# EAGLE design MPR121_ATMega32u4 (EAGLE 6.4)
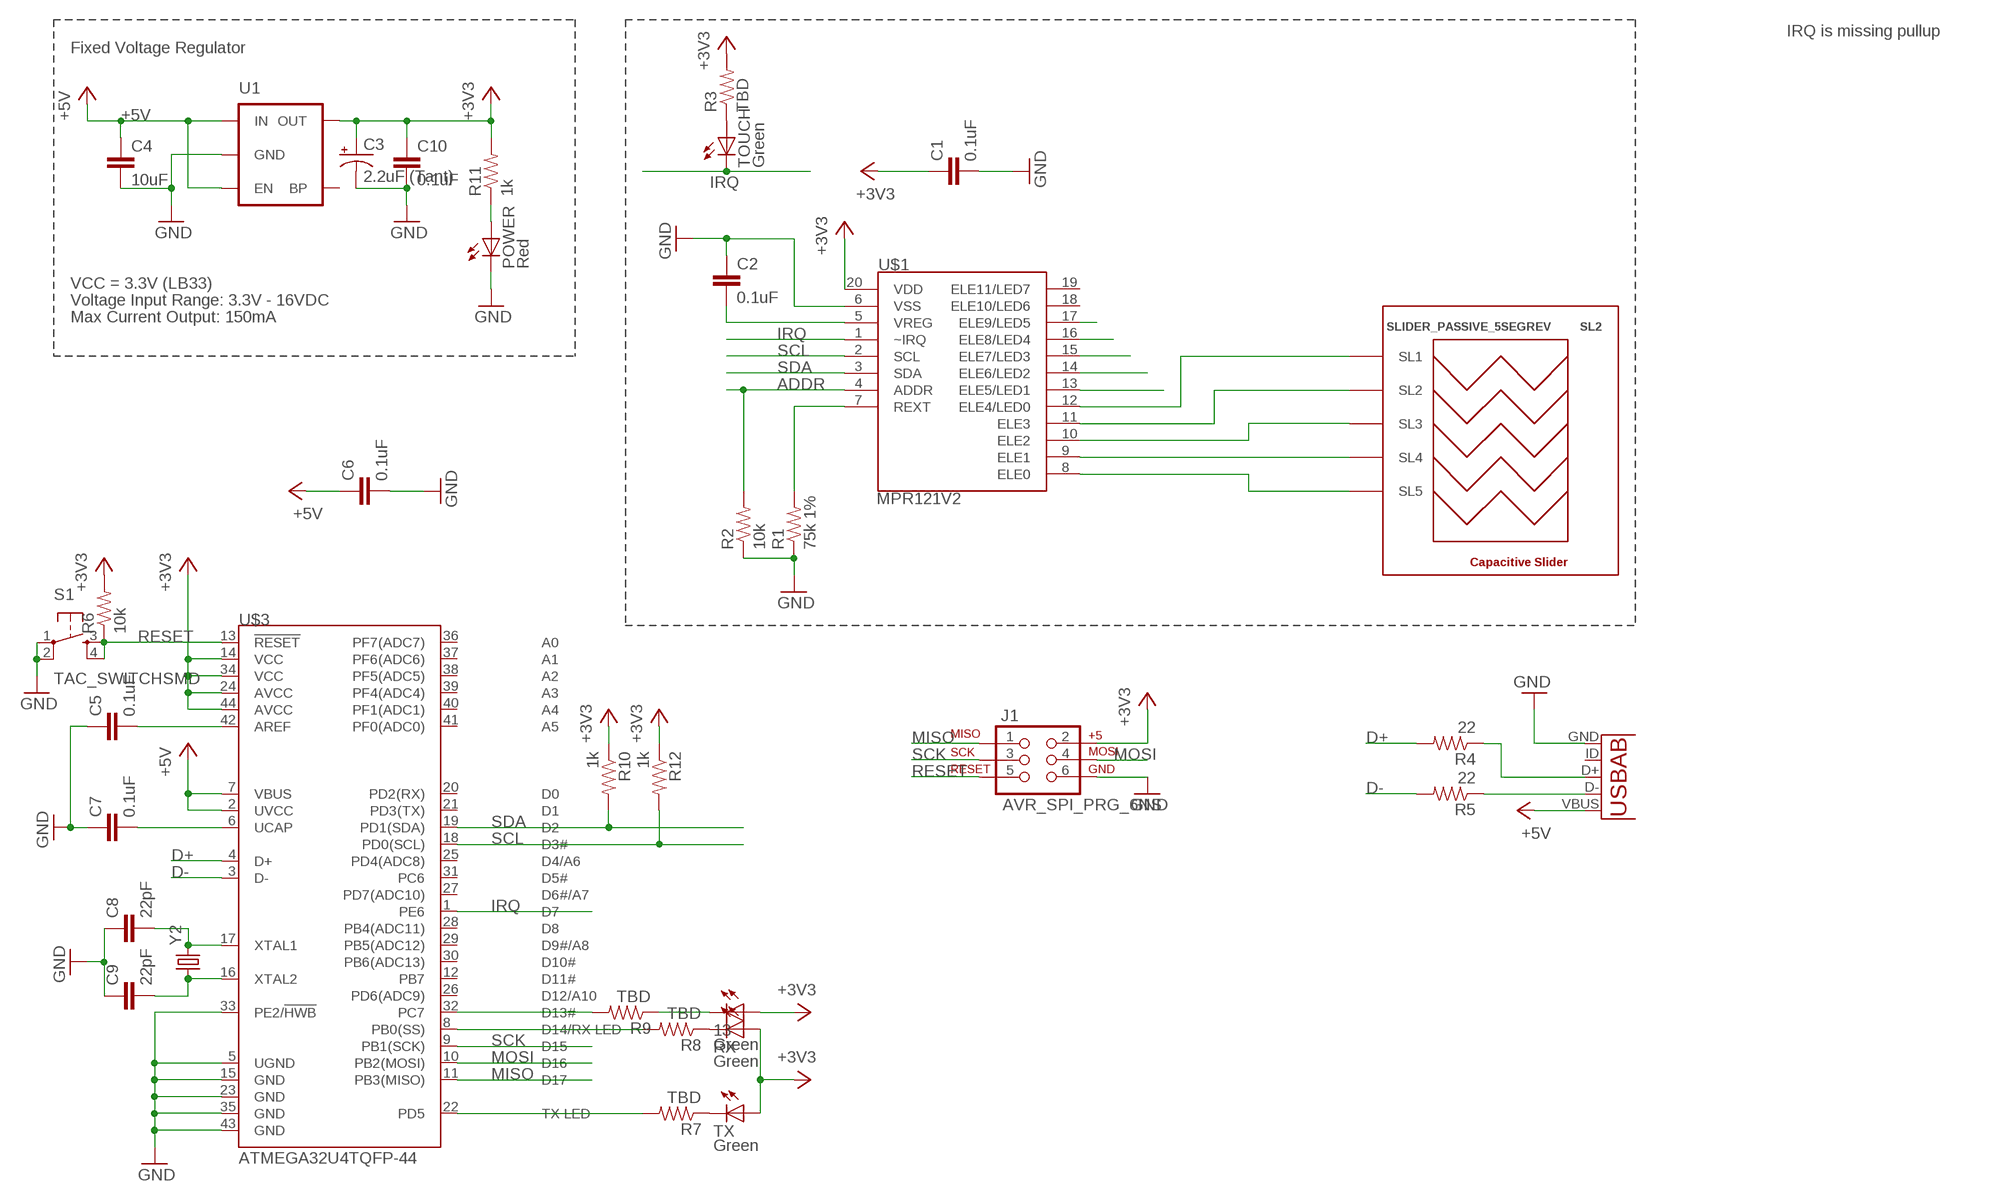
[diagram p0: schematic, sheet 1]

## Parts
13  Green  LED-RED1206  [LED-1206]
C1  0.1uF  CAP0805  [0805]
C2  0.1uF  CAP0805  [0805]
C3  2.2uF (Tant)  CAP_POL1206  [EIA3216]
C4  10uF  CAP1206  [1206]
C5  0.1uF  CAP0805  [0805]
C6  0.1uF  CAP0805  [0805]
C7  0.1uF  CAP0805  [0805]
C8  22pF  CAP0805  [0805]
C9  22pF  CAP0805  [0805]
C10  0.1uF  CAP0805  [0805]
J1  AVR_SPI_PRG_6NS  [2X3-NS]
POWER  Red  LED-RED1206  [LED-1206]
R1  75k 1%  RESISTOR0805-RES  [0805]
R2  10k  RESISTOR0805-RES  [0805]
R3  TBD  RESISTOR0805-RES  [0805]
R4  22  RESISTOR0805-RES  [0805]
R5  22  RESISTOR0805-RES  [0805]
R6  10k  RESISTOR0805-RES  [0805]
R7  TBD  RESISTOR0805-RES  [0805]
R8  TBD  RESISTOR0805-RES  [0805]
R9  TBD  RESISTOR0805-RES  [0805]
R10  1k  RESISTOR0805-RES  [0805]
R11  1k  RESISTOR0805-RES  [0805]
R12  1k  RESISTOR0805-RES  [0805]
RX  Green  LED-RED1206  [LED-1206]
S1  TAC_SWITCHSMD  [TACTILE-SWITCH-SMD]
SL2  SLIDER_PASSIVE_5SEGREV  [SLIDER_PASSIVE_5SEG_12MM_REV]
TOUCH  Green  LED-RED1206  [LED-1206]
TX  Green  LED-RED1206  [LED-1206]
U1  MIC52053.3V  [SOT23-5]
U2  USB-AB  [USB-AB-MICRO-SMD]
U$1  MPR121V2  [QFN-20-0.4MM-V2]
U$3  ATMEGA32U4TQFP-44  [TQFP44]
Y2  CRYSTAL5X3  [CRYSTAL-SMD-5X3]

## Nets
+3V3: 13.A C1.1 C3.A(+) C10.1 J1.2 R3.2 R6.2 R10.1 R11.2 R12.1 RX.A TX.A U1.5(OUT) U$1.20(VDD) U$3.14(VCC) U$3.24(AVCC) U$3.34(VCC) U$3.44(AVCC)
+5V: C4.1 C6.1 U1.1(IN) U1.3(EN) U2.VBUS U$3.2(UVCC) U$3.7(VBUS)
ADDR: R2.2 U$1.4(ADDR)
D+: R4.2 U$3.4(D+)
D-: R5.2 U$3.3(D-)
GND: C1.2 C2.1 C3.C(-) C4.2 C5.1 C6.2 C7.1 C8.1 C9.1 C10.2 J1.6 POWER.C R1.1 R2.1 S1.1 S1.2 U1.2(GND) U2.GND U$1.6(VSS) U$3.5(UGND) U$3.15(GND) U$3.23(GND) U$3.33(PE2/!HWB) U$3.35(GND) U$3.43(GND)
IRQ: TOUCH.C U$1.1(~IRQ) U$3.1(PE6)
MISO: J1.1 U$3.11(PB3(MISO))
MOSI: J1.4 U$3.10(PB2(MOSI))
N$1: C2.2 U$1.5(VREG)
N$2: R1.2 U$1.7(REXT)
N$3: SL2.SL5 U$1.8(ELE0)
N$4: SL2.SL4 U$1.9(ELE1)
N$5: SL2.SL3 U$1.10(ELE2)
N$6: SL2.SL2 U$1.11(ELE3)
N$7: SL2.SL1 U$1.12(ELE4/LED0)
N$8: U$1.13(ELE5/LED1)
N$9: U$1.14(ELE6/LED2)
N$10: U$1.15(ELE7/LED3)
N$11: U$1.16(ELE8/LED4)
N$12: U$1.17(ELE9/LED5)
N$13: R3.1 TOUCH.A
N$14: C7.2 U$3.6(UCAP)
N$15: C9.2 U$3.16(XTAL2) Y2.1
N$16: C8.2 U$3.17(XTAL1) Y2.3
N$17: R5.1 U2.D-
N$18: R4.1 U2.D+
N$19: R8.2 U$3.8(PB0(SS))
N$20: R7.2 U$3.22(PD5)
N$21: R8.1 RX.C
N$22: R7.1 TX.C
N$23: C5.2 U$3.42(AREF)
N$24: 13.C R9.1
N$25: R9.2 U$3.32(PC7)
N$38: POWER.A R11.1
RESET: J1.5 R6.1 S1.3 S1.4 U$3.13(!RESET)
SCK: J1.3 U$3.9(PB1(SCK))
SCL: R12.2 U$1.2(SCL) U$3.18(PD0(SCL))
SDA: R10.2 U$1.3(SDA) U$3.19(PD1(SDA))
Unconnected: U1.4(BP) U2.ID(USBID) U$1.18(ELE10/LED6) U$1.19(ELE11/LED7) U$3.12(PB7) U$3.20(PD2(RX)) U$3.21(PD3(TX)) U$3.25(PD4(ADC8)) U$3.26(PD6(ADC9)) U$3.27(PD7(ADC10)) U$3.28(PB4(ADC11)) U$3.29(PB5(ADC12)) U$3.30(PB6(ADC13)) U$3.31(PC6) U$3.36(PF7(ADC7)) U$3.37(PF6(ADC6)) U$3.38(PF5(ADC5)) U$3.39(PF4(ADC4)) U$3.40(PF1(ADC1)) U$3.41(PF0(ADC0))

## Notes on the sheet
- IRQ is missing pullup
- Fixed Voltage Regulator
- VCC = 3.3V (LB33)
- Voltage Input Range: 3.3V - 16VDC
- Max Current Output: 150mA

## Library data of the parts
13 POWER RX TOUCH TX = SparkFun-LED:LED-RED: Assorted Red LEDs LilyPad 1206- DIO-09912 1206- DIO-00809 0603- DIO-00819; PROD_ID: DIO-00809; VALUE: RED
C1 C2 C4-C10 = SparkFun-Capacitors:CAP: Capacitor Standard 0603 ceramic capacitor, and 0.1" leaded capacitor.
C3 = SparkFun-Capacitors:CAP_POL: Capacitor Polarized These are standard SMD and PTH capacitors. Normally 10uF, 47uF, and 100uF in electrolytic and tantalum varieties. Always verify the external diameter of the through hole cap, it varies with capacity, voltage, and manufacturer. The EIA devices should be standard.
J1 = SparkFun-Connectors:AVR_SPI_PRG_6: AVR ISP 6 Pin This is the reduced ISP connector for AVR programming. Common on Arduino. This footprint will take up less PCB space and can be used with a 10-pin to 6-pin adapter such as SKU: BOB-08508 **Special note about "TEST_POINT" package. The stop mask is on the top side, so if you want your programming test points to be on the bottom of your board, make sure to place this package on the bottom side of the board. This also ensure that the orientation to program from the bottom side will be correct.
R1-R3 R7-R10 R12 = SparkFun-Passives:RESISTOR: Resistor Basic schematic elements and footprints for 0603, 1206, and PTH resistors.
R4-R6 R11 = SparkFun-Resistors:RESISTOR: Resistor Basic schematic elements and footprints for 0603, 1206, and PTH resistors.
S1 = SparkFun-Electromechanical:TAC_SWITCH: Momentary Switch Button commonly used for reset or general input. Spark Fun Electronics SKU : COM-00097 SMT- SWCH-08247; PROD_ID: SWCH-08247
SL2 = PatternAgents-TouchWidgets:SLIDER_PASSIVE_5SEG: Slider, Passive Touch/Capacitive Sensing Type, Five (5) Segment Source : http://www.PatternAgents.com Github : https://github.com/PatternAgents License : http://creativecommons.org/licenses/by-sa/3.1/ (Creative Commons 3.1) THIS SOFTWARE IS PROVIDED BY THE CONTRIBUTORS "AS IS" AND WITHOUT ANY EXPRESS OR IMPLIED WARRANTIES, INCLUDING, BUT NOT LIMITED TO, THE IMPLIED WARRANTIES OF MERCHANTABILITY AND FITNESS FOR A PARTICULAR PURPOSE ARE DISCLAIMED. IN NO EVENT SHALL THE COPYRIGHT OWNER OR CONTRIBUTORS BE LIABLE FOR ANY DIRECT, INDIRECT, INCIDENTAL, SPECIAL, EXEMPLARY, OR CONSEQUENTIAL DAMAGES (INCLUDING, BUT NOT LIMITED TO, PROCUREMENT OF SUBSTITUTE GOODS OR SERVICES; LOSS OF USE, DATA, OR PROFITS; OR BUSINESS INTERRUPTION) HOWEVER CAUSED AND ON ANY THEORY OF LIABILITY, WHETHER IN CONTRACT, STRICT LIABILITY, OR TORT (INCLUDING NEGLIGENCE OR OTHERWISE) ARISING IN ANY WAY OUT OF THE USE OF THIS SOFTWARE, EVEN IF ADVISED OF THE POSSIBILITY OF SUCH DAMAGE.
U1 = SparkFun-PowerIC:MIC5205: MIC5205 150mA vreg 3.3V - VREG-00822 5V - VREG-00823; PROD_ID: VREG-00822
U2 = SparkFun-Connectors:USB-AB: This is a USB AB connector that is compatible with USB OTG. i.e. this connector can serve as a host or device
U$1 = SparkFun-Sensors:MPR121: MPR121 Capacitive Touch Sensor Controller. Variant "V2" was created using an image import of the bottom of the IC. It matches metal to metal.
U$3 = SparkFun-DigitalIC:ATMEGA32U4: Atmel 44-pin 8-bit Microcontroller with 32KBytes of ISP Flash and USB Controller
Y2 = SparkFun-FreqCtrl:CRYSTAL: Various standard crystals. Proven footprints. Spark Fun Electronics SKU : COM-00534

## Net classes
0 default: width 0.203 mm
1 vcc: width 0.254 mm

## Board
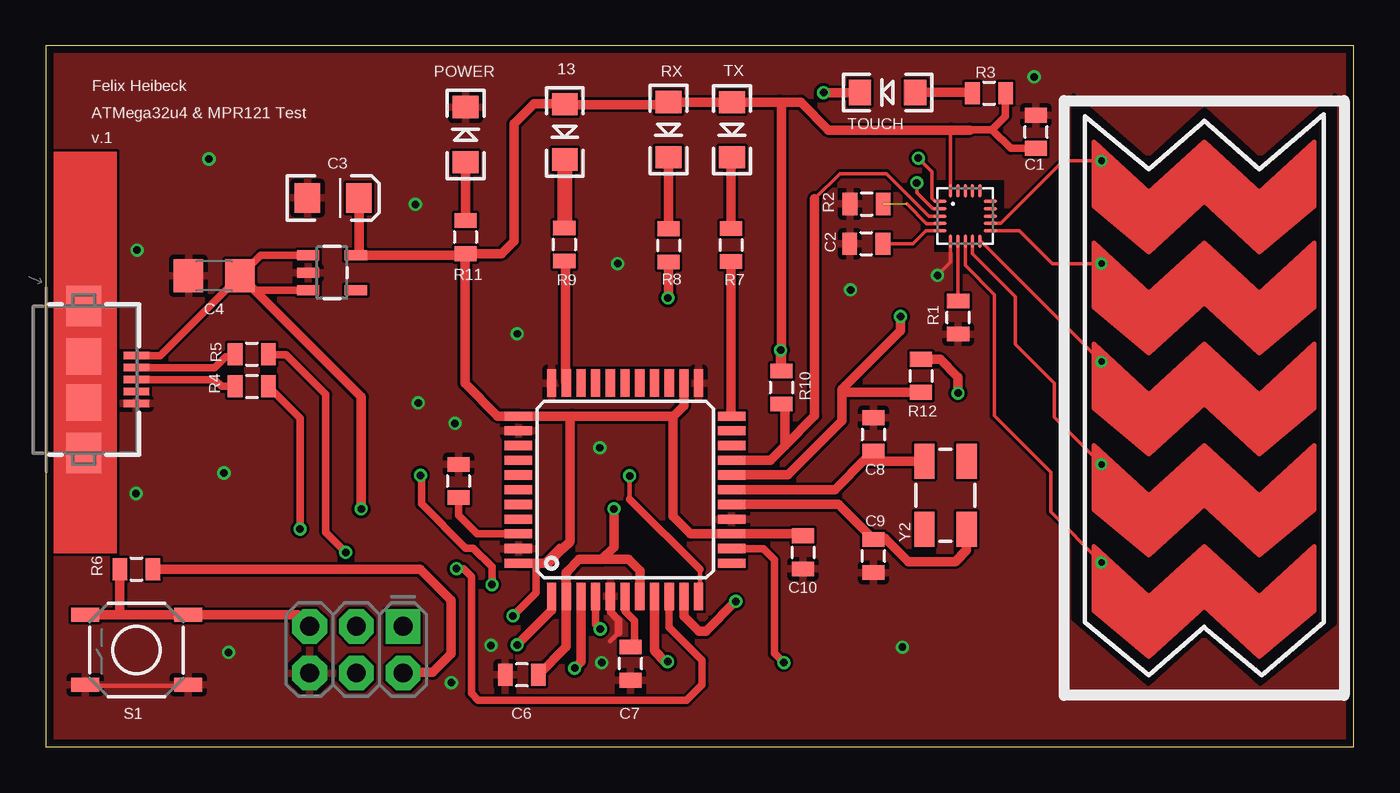
[diagram p1: board, top side]
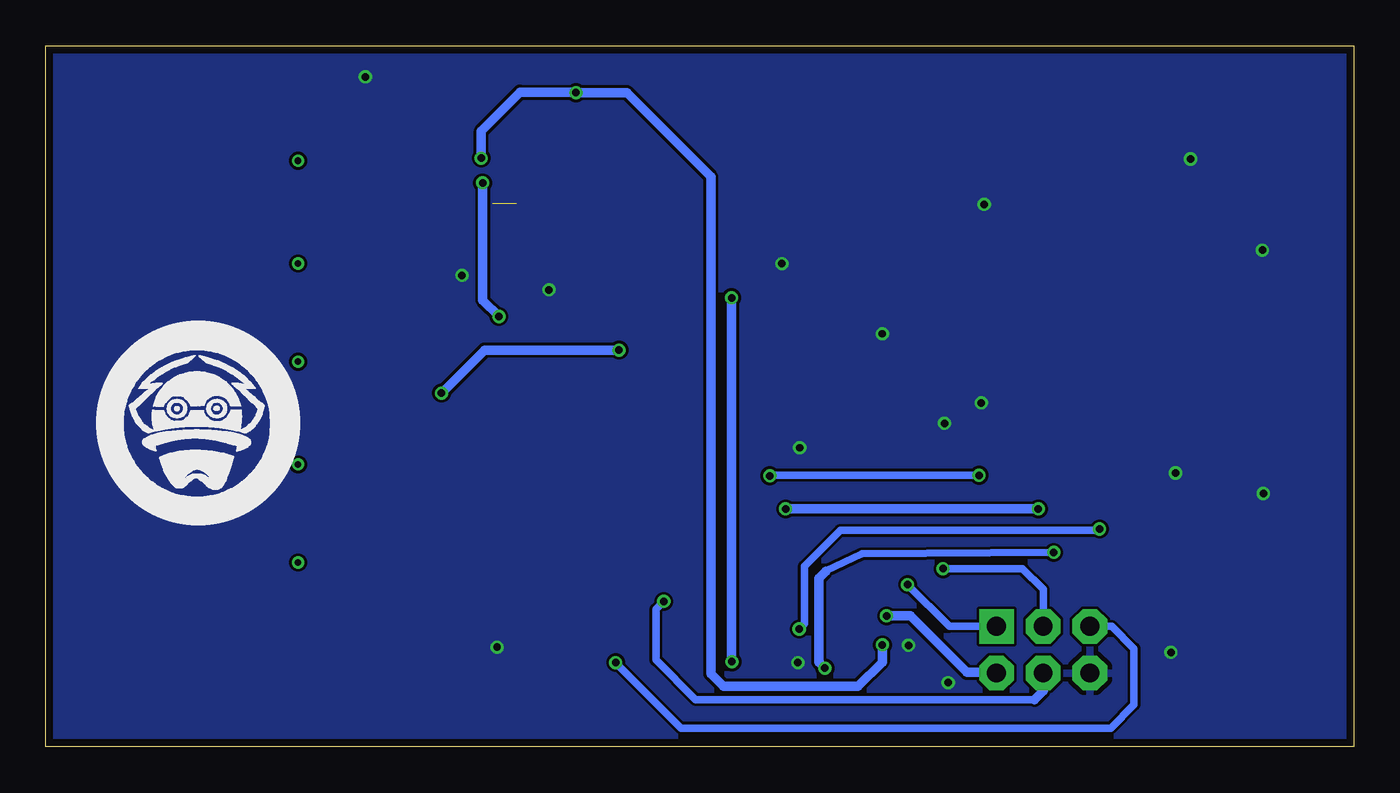
[diagram p2: board, bottom side, seen from below]

Size 71.12 x 38.1 mm. Coordinates in mm from the lower left corner, seen from the top.
Outline: 0,0 71.12,0 71.12,38.1 0,38.1 0,0
Copper layers (1*16): Top 0.035mm / dielectric 1.5mm / Bottom 0.035mm
Design rules "default *": minimum track width 10mil, minimum drill 24mil, track to track 6mil, track to pad 6mil, pad to pad 6mil, via to via 6mil, smd to smd 6mil, copper to edge 16mil, drill to drill 8mil, minimum pad ring 6mil, minimum via ring 6mil, stop-mask expansion 4mil, vias tented up to drill 0mil, thermal gap 10mil
tRestrict: area 48.3,26.9 to 52.1,30.8

### Footprints (pad centres in the part's own frame; a part is rotated, then mirrored left to right if it is on the bottom)
LED-1206 = smd 1.2 x 1.4: A -1.5,0; C 1.5,0
0805 = smd 0.8 x 1.2: 1 -0.9,0; 2 0.9,0
EIA3216 = smd 1.4 x 1.6: A 1.4,0; C -1.4,0
1206 = smd 1.6 x 1.8: 1 -1.4,0; 2 1.4,0
2X3-NS = drill 1.016 pad 1.88 square: 1 -2.54,-1.27 | drill 1.016 pad 1.88 octagon: 2 -2.54,1.27; 3 0,-1.27; 4 0,1.27; 5 2.54,-1.27; 6 2.54,1.27
TACTILE-SWITCH-SMD = smd 1.524 x 0.762: 1 -2.794,1.905; 2 2.794,1.905; 3 -2.794,-1.905; 4 2.794,-1.905
SLIDER_PASSIVE_5SEG_12MM_REV = drill 0.356: SL1 5.588,-13.208; SL2 5.588,-7.62; SL3 5.588,-2.286; SL4 5.588,3.302; SL5 5.588,8.636
SOT23-5 = smd 0.55 x 1.2: 1 -0.95,-1.3; 2 0,-1.3; 3 0.95,-1.3; 4 0.95,1.3; 5 -0.95,1.3
USB-AB-MICRO-SMD = smd 1.4 x 0.4: D+ 2.85,0; D- 2.85,0.65; GND 2.85,-1.3; ID 2.85,-0.65; VBUS 2.85,1.3 | smd 1.9 x 2: P$6 0,1.25; P$7 0,-1.25 | smd 1.9 x 2.2: P$8 0,4; P$9 0,-4
QFN-20-0.4MM-V2 = smd 0.75 x 0.195: 1 -1.367,0.8; 2 -1.367,0.4; 3 -1.367,0; 4 -1.367,-0.4; 5 -1.367,-0.8; 11 1.375,-0.8; 12 1.375,-0.4; 13 1.375,0; 14 1.375,0.4; 15 1.375,0.8 | smd 0.195 x 0.75: 6 -0.795,-1.372; 7 -0.395,-1.372; 8 0.005,-1.372; 9 0.405,-1.372; 10 0.805,-1.372; 16 0.81,1.372; 17 0.41,1.372; 18 0.01,1.372; 19 -0.39,1.372; 20 -0.79,1.372
TQFP44 = smd 1.5 x 0.5: 1 -5.8,4; 2 -5.8,3.2; 3 -5.8,2.4; 4 -5.8,1.6; 5 -5.8,0.8; 6 -5.8,0; 7 -5.8,-0.8; 8 -5.8,-1.6; 9 -5.8,-2.4; 10 -5.8,-3.2; 11 -5.8,-4; 23 5.8,-4; 24 5.8,-3.2; 25 5.8,-2.4; 26 5.8,-1.6; 27 5.8,-0.8; 28 5.8,0; 29 5.8,0.8; 30 5.8,1.6; 31 5.8,2.4; 32 5.8,3.2; 33 5.8,4 | smd 0.5 x 1.5: 12 -4,-5.8; 13 -3.2,-5.8; 14 -2.4,-5.8; 15 -1.6,-5.8; 16 -0.8,-5.8; 17 0,-5.8; 18 0.8,-5.8; 19 1.6,-5.8; 20 2.4,-5.8; 21 3.2,-5.8; 22 4,-5.8; 34 4,5.8; 35 3.2,5.8; 36 2.4,5.8; 37 1.6,5.8; 38 0.8,5.8; 39 0,5.8; 40 -0.8,5.8; 41 -1.6,5.8; 42 -2.4,5.8; 43 -3.2,5.8; 44 -4,5.8
CRYSTAL-SMD-5X3 = smd 1.9 x 1.1: 1 -1.85,-1.15; 2 1.85,-1.15; 3 1.85,1.15; 4 -1.85,1.15

### Placement (x,y rotation side)
13  28.22,33.43 270 top
C1  53.85,33.43 90 top
C2  44.62,27.35 0 top
C3  15.62,29.83 0 top
C4  9.16,25.6 180 top
C5  22.44,14.44 270 top
C6  25.88,3.91 180 top
C7  31.79,4.52 90 top
C8  45.01,16.98 270 top
C9  45.01,10.37 90 top
C10  41.18,10.57 270 top
J1  16.88,5.28 180 top
POWER  22.82,33.28 90 top
R1  49.61,23.33 90 top
R2  44.63,29.51 0 top
R3  51.3,35.54 0 top
R4  11.19,19.59 0 top
R5  11.2,21.34 0 top
R6  4.92,9.66 0 top
R7  37.27,27.28 270 top
R8  33.86,27.26 270 top
R9  28.19,27.3 270 top
R10  40.01,19.53 270 top
R11  22.82,27.71 270 top
R12  47.6,20.17 270 top
RX  33.86,33.55 270 top
S1  4.93,5.26 180 top
SL2  63,18.65 180 top
TOUCH  45.78,35.57 180 top
TX  37.32,33.55 270 top
U1  15.56,25.78 270 top
U2  2.07,19.96 0 top
U$1  49.99,28.85 0 top
U$3  31.5,13.98 90 top
Y2  48.92,13.68 90 top

### Tracks (layer width: path | path; a pad name or v marks a point on that pad's centre or on a via)
+3V3  (via drill 0.41)
  Top 0.203: U$1.20 49.2,33.51 49.23,33.53
  Top 0.254: 26.67,9.65 27.94,10.92 28.11,10.76
  Top 0.406: v25.4,7.11 26.67,8.38 26.67,9.65 | R3.2 52.2,34.29 51.46,33.55 | 51.46,33.55 50.27,33.55 50.24,33.53 | C1.1 52.48,32.53 51.46,33.55
  Top 0.508: C10.1 41.08,11.57 U$3.14 35.06,11.57 34.11,12.52 34.11,17.96 34.13,17.98 | 28.6,17.98 U$3.34 24.57,17.98 22.78,19.76 22.78,26.77 R11.2 | 28.6,17.98 34.13,17.98 | 34.13,17.98 34.7,18.54 U$3.24 | U$3.44 27.32,9.97 28.11,10.76 28.5,11.15 28.5,17.87 28.6,17.98 | 39.88,35.05 TX.A RX.A 33.7,34.89 28.25,34.89 13.A 28.2,34.95 26.54,34.95 25.45,33.86 25.45,27.48 24.77,26.81 R11.2 | 39.88,35.05 41.05,35.05 42.57,33.53 49.23,33.53 50.24,33.53 | R11.2 22.74,26.73 U1.5 17.02,26.89 C3.A | R6.2 20.34,9.66 22.05,7.95 22.05,5.05 21.03,4.04 19.45,4.04 J1.2 | v39.95,21.57 39.95,20.43 R10.1 40.01,34.92 39.88,35.05 | v49.61,19.23 49.61,20.09 48.64,21.06 47.61,21.06 R12.1
  Bottom 0.508: v25.4,7.11 24.11,7.11 21.03,4.04 19.45,4.04 J1.2 | v39.95,21.57 47.27,21.57 v49.61,19.23
+5V  (via drill 0.41)
  Top 0.406: U2.VBUS 6.22,21.26 C4.1 | U1.1 11.68,26.73 C4.1 | U1.3 11.33,24.83 10.93,25.23 C4.1
  Top 0.508: U$3.7 32.3,9.56 31.67,10.19 30.23,10.19 | U$3.2 28.3,9.45 28.37,9.53 28.37,9.55 29.01,10.19 30.23,10.19 | U$3.2 | U$3.2 28.3,5.42 C6.1 | 30.23,10.19 30.89,10.85 v30.89,12.93 | v17.14,12.93 17.14,19.02 10.93,25.23
  Bottom 0.508: v30.89,12.93 v17.14,12.93
ADDR  (1 unrouted)
  Top 0.203: 46.82,29.51 47.88,28.45 48.62,28.45 U$1.4
D+  (via drill 0.41)
  Top 0.406: U$3.4 29.9,6.65 v30.15,6.4 | v13.82,11.84 13.82,17.86 R4.2
  Bottom 0.406: v30.15,6.4 29.87,6.68 29.87,9.8 27.91,11.76 13.89,11.76 v13.82,11.84
D-  (via drill 0.41)
  Top 0.406: R5.2 12.13,21.31 13.06,21.31 15.21,19.15 15.21,11.66 v16.31,10.57
  Top 0.508: U$3.3 29.1,4.61 v28.75,4.27
  Bottom 0.406: 28.7,9.55 28.7,9.58 26.75,10.49 16.26,10.57 v16.31,10.57
  Bottom 0.508: v28.75,4.27 29.08,4.6 29.08,9.17 28.7,9.55
GND  (via drill 0.41)
  Top 0.203: U$1.6 49.2,26.34 v48.49,25.63
  Top 0.254: S1.2 2.54,3.3 7.62,3.3 S1.1 | 35.56,19.81 U$3.23 | 25.4,10.92 U$3.43 | 25.4,17.27 U$3.35 | 31.75,3.3 C7.1 | 13.97,29.97 C3.C | 22.86,35.05 POWER.C | 31.14,6.2 30.68,5.74
  Top 0.406: U$3.5 30.7,7.33 31.14,6.88 31.14,6.2
  other vias: 22.25,17.58 30.23,4.57 53.75,36.42 43.76,24.84 4.95,27 4.9,13.77 9.68,14.88 20.24,18.69 25.63,22.45 31.09,26.26 30.12,16.26 46.58,5.41 9.93,5.13 8.86,31.95 20.09,29.49 24.21,5.51 22.05,3.48
  pour Top (rank 2): -0.51,39.12 77.22,39.12 77.22,-1.27 -0.51,-1.27
  pour Bottom: -0.76,39.37 77.22,39.37 77.22,-1.27 -0.76,-1.27 -0.76,39.12
IRQ  (via drill 0.41)
  Top 0.203: U$1.1 48.35,29.65 48.18,29.82 48.18,31.27 v47.45,32
  Top 0.508: v42.29,35.56 44.27,35.56 TOUCH.C | U$3.1 27.5,7.41 v25.63,5.54
  Bottom 0.508: v47.45,32 47.45,33.48 45.34,35.59 42.32,35.59 v42.29,35.56 39.52,35.56 34.95,30.99 34.95,3.96 34.27,3.28 26.95,3.28 25.63,4.6 v25.63,5.54
MISO  (via drill 0.41)
  Top 0.254: 35.56,9.65 35.56,8.38 U$3.11 | v31.75,14.73 31.75,13.46
  Top 0.406: 31.75,13.46 35.56,9.65 | v24.26,8.81 24.26,9.78 23.24,10.79 22.84,10.79 20.42,13.21 20.42,14.71 v20.37,14.76
  Bottom 0.406: J1.1 21.99,6.55 v24.26,8.81 | v20.37,14.76 31.73,14.76 v31.75,14.73
MOSI  (via drill 0.41)
  Top 0.508: U$3.10 34.7,7.09 35.51,6.27 35.89,6.27 v37.52,7.9
  Bottom 0.406: 17.35,2.56 35.79,2.56 37.95,4.72 37.95,7.47 v37.52,7.9
  Bottom 0.508: J1.4 16.88,3.03 17.35,2.56
N$1
  Top 0.203: U$1.5 47.87,28.05 47.17,27.36 C2.2
N$2
  Top 0.203: U$1.7 49.6,24.25 R1.2
N$3
  Top 0.203: U$1.8 50,26.18 51.59,24.59 51.59,17.98 54.66,14.91 54.66,12.76 SL2.SL5
N$4
  Top 0.203: U$1.9 50.4,26.79 52.73,24.46 52.73,21.87 54.84,19.76 54.84,17.92 SL2.SL4
N$5
  Top 0.203: U$1.10 50.86,27.48 SL2.SL3
N$6
  Top 0.203: U$1.11 52.95,28.05 54.74,26.26 SL2.SL2
N$7
  Top 0.203: U$1.12 51.95,28.45 55.35,31.85 SL2.SL1
N$13
  Top 0.508: TOUCH.A 50.41,35.57 R3.1
N$14
  Top 0.406: U$3.6 31.5,7.36 32,6.86 32,5.63 C7.2
  Top 0.508: 31.5,5.46 C7.2
N$15
  Top 0.508: U$3.16 43.1,13.18 C9.2 45.07,11.33 45.64,11.33 46.91,10.06 49.45,10.06 50.07,10.68 Y2.1
N$16
  Top 0.508: U$3.17 42.9,13.97 44.6,15.67 | 44.6,15.67 C8.2 | Y2.3 44.74,15.53 44.6,15.67
N$17
  Top 0.406: U2.D- 9.19,20.61 9.77,21.19 10.15,21.19 R5.1
N$18
  Top 0.406: U2.D+ 9.19,19.96 9.56,19.59 R4.1
N$19  (via drill 0.41)
  Top 0.508: R8.2 33.86,24.44 v33.83,24.41 | v33.81,4.62 33.68,4.62 33.1,5.21 U$3.8
  Bottom 0.508: v33.83,24.41 33.83,4.65 v33.81,4.62
N$20
  Top 0.508: R7.2 37.27,18.01 U$3.22
N$21
  Top 0.508: R8.1 RX.C
N$22
  Top 0.508: R7.1 37.27,31.99 TX.C
N$23
  Top 0.406: C5.2 22.44,12.59 23.44,11.58 U$3.42
N$24
  Top 0.813: 13.C 28.22,28.23 R9.1
N$25
  Top 0.508: U$3.32 28.27,19.8 28.27,26.33 R9.2
N$38
  Top 0.508: POWER.A R11.1
RESET  (via drill 0.41)
  Top 0.406: v40.13,4.57 39.62,5.08 39.62,10.16 39.01,10.77 U$3.13
  Top 0.508: J1.5 13.72,7.17 S1.3 4.06,7.17 | S1.4 4.06,7.17 | R6.1 4.02,7.21 4.06,7.17
  Bottom 0.406: J1.5 13.15,6.55 11.94,5.33 11.94,2.29 13.21,1.02 36.58,1.02 v40.13,4.57
SCK  (via drill 0.41)
  Top 0.406: v22.33,9.68 22.71,9.68 23.14,9.25 23.14,2.9 23.5,2.54 34.85,2.54 35.69,3.38 35.69,4.7 33.88,6.5 33.88,8.16 U$3.9
  Bottom 0.406: J1.3 16.88,8.55 18.01,9.68 v22.33,9.68
SCL  (via drill 0.41)
  Top 0.203: U$1.2 48.24,29.25 47.37,30.12 v47.37,30.66
  Top 0.508: v46.48,23.39 46.48,22.61 43.5,19.62 | 43.5,19.62 43.31,19.43 43.31,17.73 40.36,14.78 U$3.18 | R12.2 43.5,19.27 43.5,19.62
  Bottom 0.508: v47.37,30.66 47.37,24.28 v46.48,23.39
SDA
  Top 0.203: U$1.3 48.03,28.85 45.72,31.17 43.18,31.17 41.81,29.79
  Top 0.508: U$3.19 39.4,15.57 40.18,16.36 | 40.18,16.36 41.81,17.98 41.81,29.79 | R10.2 40.18,18.63 40.18,16.36
(copper drawn outside any net)
  shapes: Top area x1

### Text on the board
tNames: Felix Heibeck | ATMega32u4 & MPR121 Test | v.1